# Altium schematic sheet RGBParkLight16.SCHDOC
size B
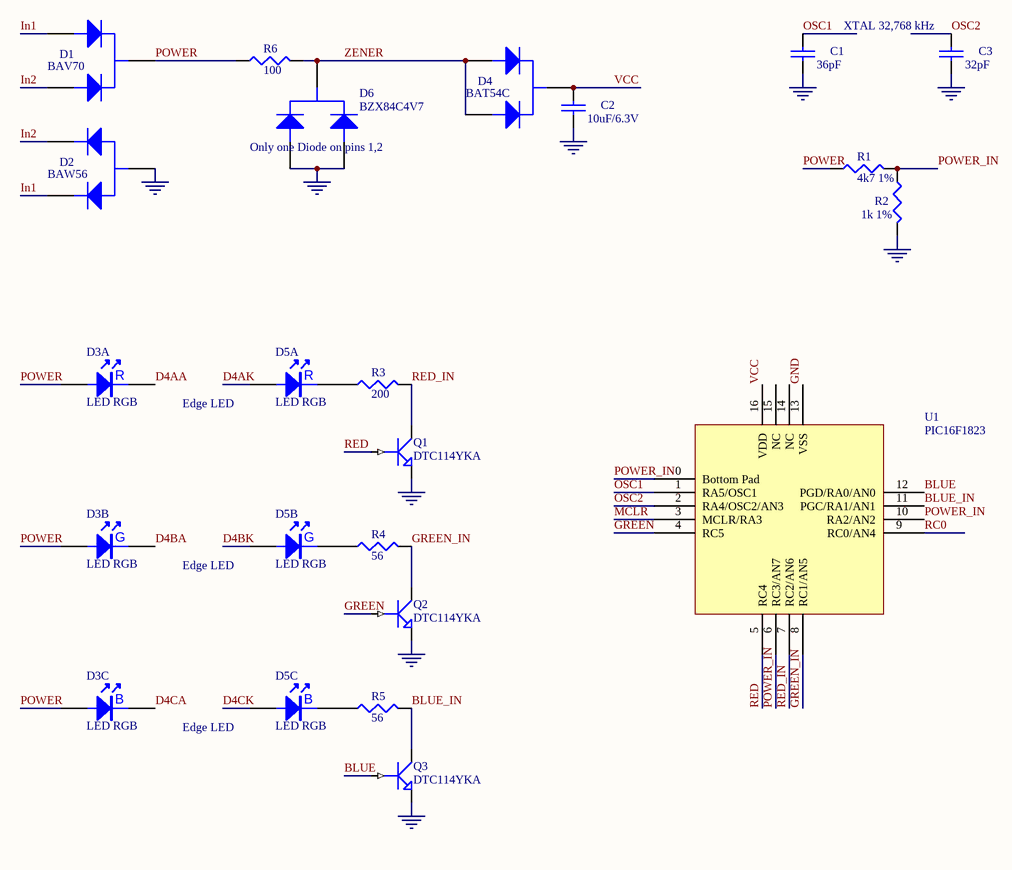
[diagram p0: RGBParkLight16.SCHDOC]

## Parts
C1  36pF  [0603]
C2  10uF/6.3V  [0805]
C3  32pF  [0603]
D1  BAV70  [SOT-23]
D2  BAW56  [SOT-23]
D3  (no value)  [AF-5060]  (parts A,B,C of 3)
D4  BAT54C  [SOT-23]
D5  (no value)  [AF-5060]  (parts A,B,C of 3)
D6  BZX84C4V7  [SOT-23]
Q1  DTC114YKA  [SOT-23]
Q2  DTC114YKA  [SOT-23]
Q3  DTC114YKA  [SOT-23]
R1  4k7 1%  [0603]
R2  1k 1%  [0603]
R3  200  [0805]
R4  56  [0805]
R5  56  [0805]
R6  100  [0603]
U1  PIC16F1823  [QFN16-ML]

## Nets
GND: C1.2 C2.2 C3.2 D2.2(A) D6.1(A1) D6.3(A2) Q1.3(E) Q2.3(E) Q3.3(E) R2.2 U1.13(VSS)
BLUE: Q3.1(B) U1.12(PGD/RA0/AN0)
BLUE_IN: Q3.2(C) R5.2 U1.11(PGC/RA1/AN1)
D4AA: D3.4(K)
D4AK: D5.3(A)
D4BA: D3.5(K)
D4BK: D5.2(A)
D4CA: D3.6(K)
D4CK: D5.1(A)
GREEN: Q2.1(B) U1.4(RC5)
GREEN_IN: Q2.2(C) R4.2 U1.8(RC1/AN5)
In1: D1.1(A1) D2.3(K2)
In2: D1.3(A2) D2.1(K1)
MCLR: U1.3(MCLR/RA3)
OSC1: C1.1 U1.1(RA5/OSC1)
OSC2: C3.1 U1.2(RA4/OSC2/AN3)
POWER: D1.2(K) D3.1(A) D3.2(A) D3.3(A) R1.1 R6.1
POWER_IN: R1.2 R2.1 U1.0(Bottom_Pad) U1.6(RC3/AN7) U1.10(RA2/AN2)
RC0: U1.9(RC0/AN4)
RED: Q1.1(B) U1.5(RC4)
RED_IN: Q1.2(C) R3.2 U1.7(RC2/AN6)
VCC: C2.1 D4.2(K) U1.16(VDD)
ZENER: D4.1(A1) D4.3(A2) D6.2(K) R6.2
NetD5_4: D5.4(K) R3.1
NetD5_5: D5.5(K) R4.1
NetD5_6: D5.6(K) R5.1

Not connected (* = marked no-connect by the designer): U1 14(NC) 15(NC)

## Notes on the sheet
- (near C3) XTAL 32,768 kHz
- (near D6) Only one Diode on pins 1,2
- Edge LED
- (in symbol LED RGB, part A) R
- (in symbol LED RGB, part B) G
- (in symbol LED RGB, part C) B

## Library data of the parts
C1-C3 = CAP: Capacitor
D1 D4 D6 = DUAL DIODE BAV70
D2 = DUAL DIODE BAW56
D3 D5 = LED RGB
Q1-Q3 = NPN1: NPN Transistor
R1-R6 = RES1
U1 = PIC16F1823_0: Microchip Microcontroller with Central Pad